# Altium schematic sheet POWER_GEN.SchDoc: =project_title
size Tabloid; CompanyName: Luxonis Holding; Organization: Luxonis Holding; Address1: 1925 Harmony Park Drive; Address2: Westminster, CO; Address3: 80234; Address4: United States; SheetNumber: 4; SheetTotal: 14
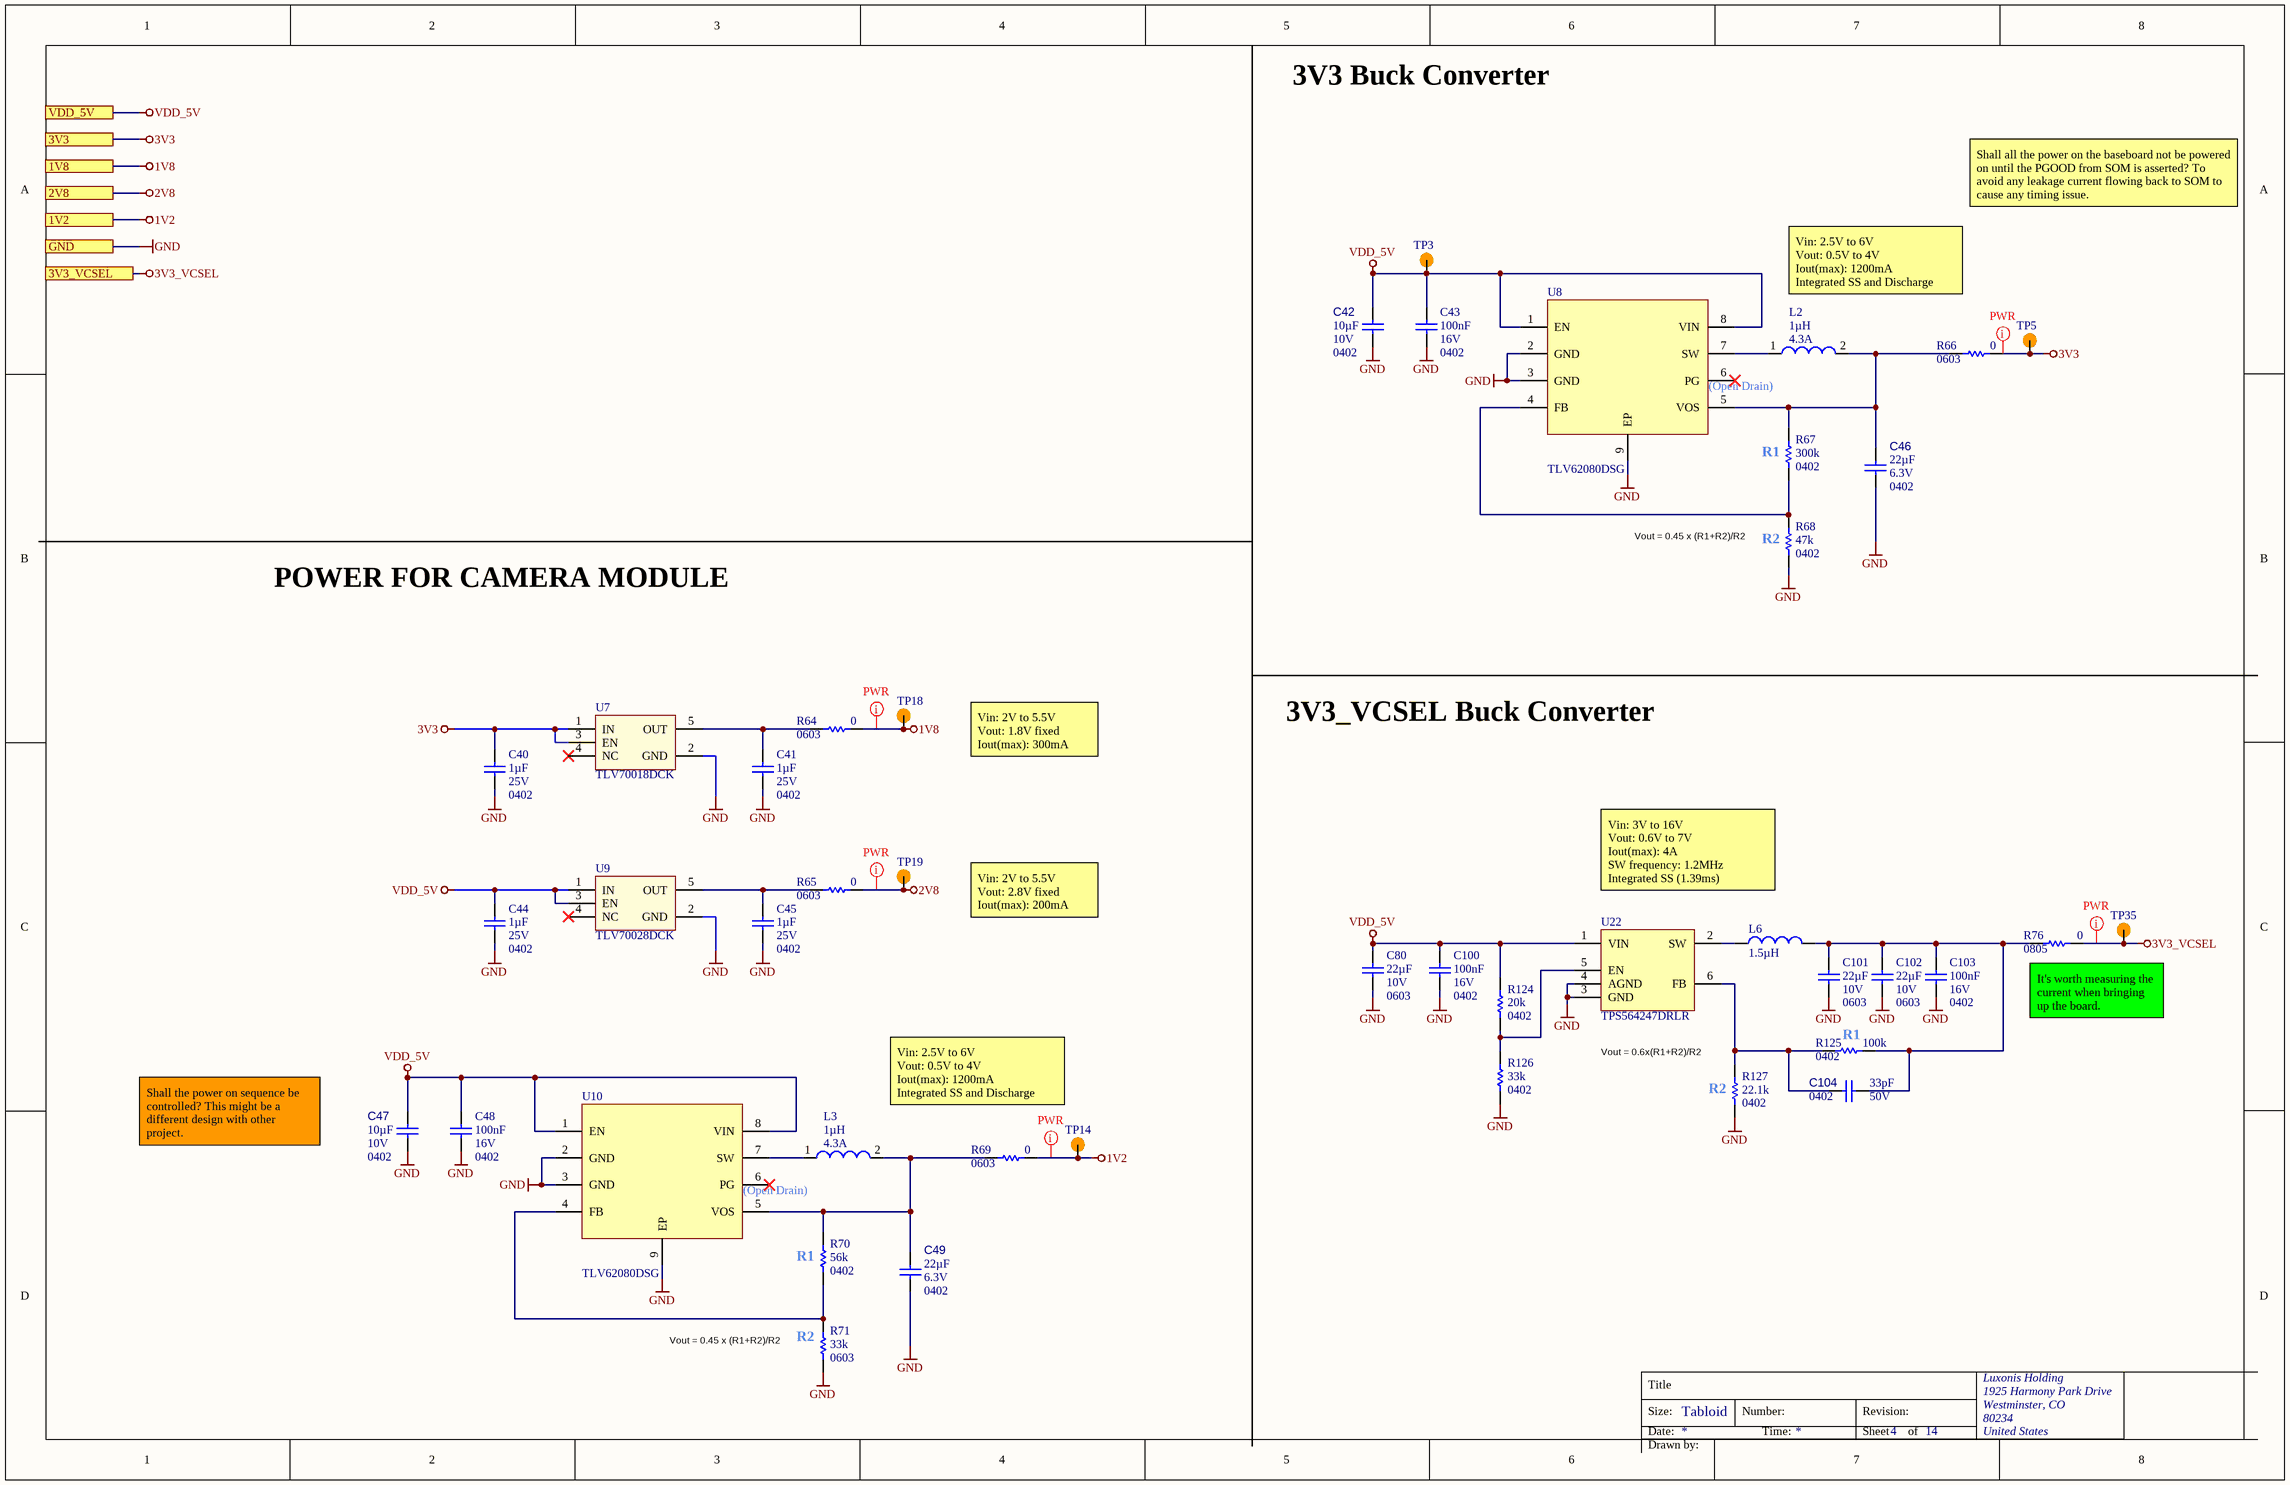
[diagram p0: POWER_GEN.SchDoc]

## Parts
C40  value 1µF  Voltage Rating: 25V  Case/Package: 0402  [CAPC0402(1005)70_N]  (hidden comment: GRM155R61E105KA12D)
C41  value 1µF  Voltage Rating: 25V  Case/Package: 0402  [CAPC0402(1005)70_N]  (hidden comment: GRM155R61E105KA12D)
C42  value 10µF  Voltage Rating: 10V  Case/Package: 0402  [CAPC0402(1005)60_L]  (hidden comment: GRM155R61A106ME11D)
C43  value 100nF  Voltage Rating: 16V  Case/Package: 0402  [CAPC0402(1005)60_N]  (hidden comment: CL05B104KO5NFNC)
C44  value 1µF  Voltage Rating: 25V  Case/Package: 0402  [CAPC0402(1005)70_N]  (hidden comment: GRM155R61E105KA12D)
C45  value 1µF  Voltage Rating: 25V  Case/Package: 0402  [CAPC0402(1005)70_N]  (hidden comment: GRM155R61E105KA12D)
C46  value 22µF  Voltage Rating: 6.3V  Case/Package: 0402  [CAPC0402(1005)60_L]  (hidden comment: CL05A226MQ5N6J8)
C47  value 10µF  Voltage Rating: 10V  Case/Package: 0402  [CAPC0402(1005)60_L]  (hidden comment: GRM155R61A106ME11D)
C48  value 100nF  Voltage Rating: 16V  Case/Package: 0402  [CAPC0402(1005)60_N]  (hidden comment: CL05B104KO5NFNC)
C49  value 22µF  Voltage Rating: 6.3V  Case/Package: 0402  [CAPC0402(1005)60_L]  (hidden comment: CL05A226MQ5N6J8)
C80  value 22µF  Voltage Rating: 10V  Case/Package: 0603  [CAPC0603(1608)100_N]  (hidden comment: GRM188R61A226ME15D)
C100  value 100nF  Voltage Rating: 16V  Case/Package: 0402  [CAPC0402(1005)60_N]  (hidden comment: CL05B104KO5NFNC)
C101  value 22µF  Voltage Rating: 10V  Case/Package: 0603  [CAPC0603(1608)100_N]  (hidden comment: GRM188R61A226ME15D)
C102  value 22µF  Voltage Rating: 10V  Case/Package: 0603  [CAPC0603(1608)100_N]  (hidden comment: GRM188R61A226ME15D)
C103  value 100nF  Voltage Rating: 16V  Case/Package: 0402  [CAPC0402(1005)60_N]  (hidden comment: CL05B104KO5NFNC)
C104  value 33pF  Voltage Rating: 50V  Case/Package: 0402  [FP-GCM155-0_05-IPC_A]  (hidden comment: GCM1555C1H330JA16D)
L2  value 1µH  Current Rating: 4.3A  [DFE252012P-1R0M=P2]  (hidden comment: DFE252012P-1R0M=P2)
L3  value 1µH  Current Rating: 4.3A  [DFE252012P-1R0M=P2]  (hidden comment: DFE252012P-1R0M=P2)
L6  value 1.5µH  [FP-SRP6540-MFG]  (hidden comment: SRP6540-1R5M)
R64  value 0  Case/Package: 0603  [RESC0603(1608)_N]  (hidden comment: CRCW06030000Z0EA)
R65  value 0  Case/Package: 0603  [RESC0603(1608)_N]  (hidden comment: CRCW06030000Z0EA)
R66  value 0  Case/Package: 0603  [RESC0603(1608)_N]  (hidden comment: CRCW06030000Z0EA)
R67  value 300k  Case/Package: 0402  [RESC0402(1005)_N]  (hidden comment: RC0402FR-07300KL)
R68  value 47k  Case/Package: 0402  [RESC0402(1005)_L]  (hidden comment: RC0402FR-0747KL)
R69  value 0  Case/Package: 0603  [RESC0603(1608)_N]  (hidden comment: CRCW06030000Z0EA)
R70  value 56k  Case/Package: 0402  [RESC0402(1005)_L]  (hidden comment: RC0402FR-0756KL)
R71  value 33k  Case/Package: 0603  [RESC1608X55X25LL10T15]  (hidden comment: RC0603FR-0733KL)
R76  value 0  Case/Package: 0805  [RESC0805(2012)_L]  (hidden comment: CRCW08050000Z0EA)
R124  value 20k  Case/Package: 0402  [RESC0402(1005)_L]  (hidden comment: RC0402FR-0720KL)
R125  value 100k  Case/Package: 0402  [RESC0402(1005)_L]  (hidden comment: RC0402FR-07100KL)
R126  value 33k  Case/Package: 0402  [RESC0402(1005)_L]  (hidden comment: CRCW040233K0FKED)
R127  value 22.1k  Case/Package: 0402  [RESC0402(1005)_N]  (hidden comment: RC0402FR-0722K1L)
TP3  TP075_150_NS  [TP075_150_NS]  (value not drawn)  (no BOM)
TP5  TP075_150_NS  [TP075_150_NS]  (value not drawn)  (no BOM)
TP14  TP075_150_NS  [TP075_150_NS]  (value not drawn)  (no BOM)
TP18  TP075_150_NS  [TP075_150_NS]  (value not drawn)  (no BOM)
TP19  TP075_150_NS  [TP075_150_NS]  (value not drawn)  (no BOM)
TP35  TP075_150_NS  [TP075_150_NS]  (value not drawn)  (no BOM)
U7  TLV70018DCK  [TLV70018DCK]
U8  TLV62080DSG  [TLV62080DSG]
U9  TLV70028DCK  [TLV70028DCK]
U10  TLV62080DSG  [TLV62080DSG]
U22  TPS564247DRLR  [TPS564247DRLR-Footprint-1]

## Ports
1V2, 1V8, 2V8, 3V3, 3V3_VCSEL, GND, VDD_5V

## Nets
1V2: R69.2 TP14.1 ; port 1V2
1V8: R64.2 TP18.1 ; port 1V8
2V8: R65.2 TP19.1 ; port 2V8
3V3: C40.2 R66.2 TP5.1 U7.1(IN) U7.3(EN) ; port 3V3
3V3_VCSEL: R76.2 TP35.1 ; port 3V3_VCSEL
GND: C40.1 C41.1 C42.1 C43.1 C44.1 C45.1 C46.1 C47.1 C48.1 C49.1 C80.1 C100.1 C101.1 C102.1 C103.1 R68.1 R71.1 R126.1 R127.1 U7.2(GND) U8.2(GND) U8.3(GND) U8.9(EP) U9.2(GND) U10.2(GND) U10.3(GND) U10.9(EP) U22.3(GND) U22.4(AGND) ; port GND
VDD_5V: C42.2 C43.2 C44.2 C47.2 C48.2 C80.2 C100.2 R124.2 TP3.1 U8.1(EN) U8.8(VIN) U9.1(IN) U9.3(EN) U10.1(EN) U10.8(VIN) U22.1(VIN) ; port VDD_5V
NetC41_2: C41.2 R64.1 U7.5(OUT)
NetC45_2: C45.2 R65.1 U9.5(OUT)
NetC46_2: C46.2 L2.2 R66.1 R67.2 U8.5(VOS)
NetC49_2: C49.2 L3.2 R69.1 R70.2 U10.5(VOS)
NetC101_2: C101.2 C102.2 C103.2 C104.1 L6.2 R76.1 R125.1
NetC104_2: C104.2 R125.2 R127.2 U22.6(FB)
NetL2_1: L2.1 U8.7(SW)
NetL3_1: L3.1 U10.7(SW)
NetL6_1: L6.1 U22.2(SW)
NetR67_1: R67.1 R68.2 U8.4(FB)
NetR70_1: R70.1 R71.2 U10.4(FB)
NetR124_1: R124.1 R126.2 U22.5(EN)

Not connected (* = marked no-connect by the designer): U7 4(NC)*; U8 6(PG)*; U9 4(NC)*; U10 6(PG)*

## Layout directives
net class PWR; Current Rating: 200mA: 1V8
net class PWR; Current Rating: 300mA: 2V8
net class PWR; Current Rating: 1200mA: 1V2, 3V3
net class PWR; Current Rating: 3A: 3V3_VCSEL

## Notes on the sheet
- 3V3 Buck Converter
- Shall all the power on the baseboard not be powered on until the PGOOD from SOM is asserted? To avoid any leakage current flowing back to SOM to cause any timing issue.
- Vin: 2.5V to 6V
  Vout: 0.5V to 4V
  Iout(max): 1200mA
  Integrated SS and Discharge
- (near U8) (Open Drain)
- (near R67) R1
- (near R68) Vout = 0.45 x (R1+R2)/R2
- (near R68) R2
- POWER FOR CAMERA MODULE
- Vin: 2V to 5.5V
  Vout: 1.8V fixed
  Iout(max): 300mA
- 3V3_VCSEL Buck Converter
- Vin: 3V to 16V
  Vout: 0.6V to 7V
  Iout(max): 4A
  SW frequency: 1.2MHz
  Integrated SS (1.39ms)
- Vin: 2V to 5.5V
  Vout: 2.8V fixed
  Iout(max): 200mA
- It's worth measuring the current when bringing up the board.
- (near R127) Vout = 0.6x(R1+R2)/R2
- (near R127) R2
- (near R125) R1
- Shall the power on sequence be controlled? This might be a different design with other project.
- (near U10) (Open Drain)
- (near R70) R1
- (near R71) Vout = 0.45 x (R1+R2)/R2
- (near R71) R2
- Title
- Size:
- Date:
- Tabloid
- Number:
- Time:
- Revision:
- Sheet
- of
- Drawn by:

## Library data of the parts
C40 C41 C44 C45 = CMP-108-000014-5: CAP CER 1UF 25V X5R 0402 10%; Manufacturer 1: Murata; ComponentLink2Description: https://datasheet.ciiva.com/7719/1666664-7719006.pdf?src-supplier=Element14; ComponentLink2URL: https://datasheet.ciiva.com/7719/1666664-7719006.pdf?src-supplier=Element14; Max Operating Temperature: 85°C; Depth: 0.5mm; Mounting Technology: SMT; ComponentLink1URL: https://datasheet.ciiva.com/22732/1666664-22732122.pdf?src-supplier=Element14; Length: 1mm; ComponentLink1Description: https://datasheet.ciiva.com/22732/1666664-22732122.pdf?src-supplier=Element14; Manufacturer Part Number 1: GRM155R61E105KA12D; Tolerance: 10%; Design Item ID: GRM155R61E105KA12D; Dielectric: X5R; Min Operating Temperature: -55°C; Height: 0.5mm; Width: 0.5mm
C42 C47 = CMP-001-00125-4: CAP CER 10UF 10V X5R 0402 20%; Manufacturer 1: Murata; Mounting Technology: SMT; Tolerance: 20%; Manufacturer Part Number 1: GRM155R61A106ME11D; Dielectric: X5R
C43 C48 C100 C103 = CMP-108-000002-6: CAP CER 0.1UF 16V X7R 0402 10%; Manufacturer 1: Samsung; ComponentLink1URL: https://datasheet.ciiva.com/25767/cl05b104ko5nfnc-25767124.pdf?src-supplier=Digi-Key; Length: 1mm; Design Item ID: CL05B104KO5NFNC; Tolerance: 10%; Min Operating Temperature: -55°C; Width: 0.02inch; Dielectric: X7R; ComponentLink1Description: https://datasheet.ciiva.com/25767/cl05b104ko5nfnc-25767124.pdf?src-supplier=Digi-Key; Height: 0.5mm; Depth: 0.5mm; Manufacturer Part Number 1: CL05B104KO5NFNC; Max Operating Temperature: 125°C; Mounting Technology: SMT
C46 C49 = CMP-001-00163-4: CAP CER 22UF 6.3V X5R 0402 20%; Manufacturer 1: Samsung; Manufacturer Part Number 1: CL05A226MQ5N6J8; Mounting Technology: Surface Mount; Tolerance: 20%
C80 C101 C102 = CMP-108-000020-4: CAP CER 22UF 10V X5R 0603 20%; Manufacturer 1: Murata; ComponentLink1Description: https://datasheet.ciiva.com/46444/1769893-46444975.pdf?src-supplier=Element14; ComponentLink1URL: https://datasheet.ciiva.com/46444/1769893-46444975.pdf?src-supplier=Element14; Mounting Technology: SMT; Width: 0.8mm; Length: 1.6mm; Height: 0.8mm; Design Item ID: GRM188R61A226ME15D; Manufacturer Part Number 1: GRM188R61A226ME15D; Depth: 0.8mm; Tolerance: 20%; Min Operating Temperature: -55°C; Dielectric: X5R; Max Operating Temperature: 85°C
C104 = CMP-001-00100-6: CAP CER 33pF 50V C0G 0402 5%; Manufacturer 1: Murata; Capacitor Type: Ceramic; Mounting Technology: SMT; Dielectric: C0G; Manufacturer Part Number 1: GCM1555C1H330JA16D; Tolerance: 5%
L2 L3 = CMP-082-000001-2: FIXED IND 1UH 3.2A 42 MOHM SMD; Manufacturer: Murata; Tolerance: 20%; Manufacturer Part Number: DFE252012P-1R0M=P2; Case/Package: 1008; Manufacturer 1: Murata; Manufacturer Part Number 1: DFE252012P-1R0M=P2; Manufacturer 2: Murata; Manufacturer Part Number 2: DFE252012P-1R0M=P2; Manufacturer 3: Murata; Manufacturer Part Number 3: DFE252012P-1R0M=P2; Manufacturer 4: Murata; Manufacturer Part Number 4: DFE252012P-1R0M=P2
L6 = CMP-006-00052-1: General Purpose Inductor, 1.5uH, 20%, 1 Element, Powdered Iron-Core, SMD, 2826; Manufacturer 1: Bourns; Saturation Current: 11A; Current Rating: 11A; Tolerance: 20%; Case/Package: 2826; Manufacturer Part Number 1: SRP6540-1R5M
R64-R66 R69 = CMP-115-000011-7: RES SMD 0 OHM 5% 1/10W 0603; Manufacturer 1: Vishay; Manufacturer Part Number 1: CRCW0603-0000Z0EA; Temperature Coefficient: 100ppm/°C; Power Rating: 100mW; Voltage Rating: 75V; Tolerance: 5%; Design Item ID: CRCW06030000Z0EA; Max Operating Temperature: 155°C; Min Operating Temperature: -55°C
R67 = CMP-013-000049-8: RES SMD 300K OHM 1% 1/16W 0402; Manufacturer 1: Yageo; Voltage Rating: 50V; Power Rating: 63mW; Tolerance: 1%; Design Item ID: RC0402FR-07300KL; Max Operating Temperature: 155°C; Manufacturer Part Number 1: RC0402FR-07300KL; Min Operating Temperature: -55°C
R68 = CMP-013-000015-9: RES SMD 47K OHM 1% 1/16W 0402; Manufacturer 1: Yageo; Power Rating: 62.5mW; Voltage Rating: 50V; Max Operating Temperature: 155°C; Tolerance: 1%; Min Operating Temperature: -55°C; Manufacturer Part Number 1: RC0402FR-0747KL; Design Item ID: RC0402FR-0747KL
R70 = CMP-013-000017-11: RES SMD 56K OHM 1% 1/16W 0402; Manufacturer 1: Yageo; Power Rating: 62.5mW; Voltage Rating: 50V; Manufacturer Part Number 1: RC0402FR-0756KL; Tolerance: 1%; Min Operating Temperature: -55°C; Max Operating Temperature: 155°C
R71 = CMP-009-00229-8: RES SMD 33K OHM 1% 0.1W 0603; Manufacturer 1: Yageo; Voltage Rating: 75V; Power Rating: 100mW; Mounting Technology: SMD; Tolerance: 1%; Pins: 2; Manufacturer Part Number 1: RC0603FR-0733KL
R76 = CMP-013-000034-9: RES SMD 0 OHM 1% 1/8W 0805; Manufacturer 1: Vishay; Power Rating: 125mW; Manufacturer Part Number 1: CRCW08050000Z0EA; Max Operating Temperature: 155°C; Min Operating Temperature: -55°C; Design Item ID: CRCW08050000Z0EA
R124 = CMP-013-000011-9: RES SMD 20K OHM 1% 1/16W 0402; Manufacturer 1: Yageo; Power Rating: 62.5mW; Voltage Rating: 50V; Max Operating Temperature: 155°C; Manufacturer Part Number 1: RC0402FR-0720KL; Min Operating Temperature: -55°C; Design Item ID: RC0402FR-0720KL; Tolerance: 1%
R125 = CMP-013-000035-8: RES SMD 100K OHM 1% 1/16W 0402; Manufacturer 1: Yageo; Power Rating: 63mW; Voltage Rating: 50V; Tolerance: 1%; Min Operating Temperature: -55°C; Max Operating Temperature: 155°C; Design Item ID: RC0402FR-07100KL; Manufacturer Part Number 1: RC0402FR-07100KL
R126 = CMP-013-000025-8: RES SMD 33K OHM 1% 1/16W 0402; Manufacturer 1: Vishay; Voltage Rating: 50V; Power Rating: 63mW; Tolerance: 1%; Max Operating Temperature: 155°C; Design Item ID: CRCW040233K0FKED; Manufacturer Part Number 1: CRCW040233K0FKED; Min Operating Temperature: -55°C
R127 = CMP-013-000045-8: RES SMD 22.1K OHM 1% 1/16W 0402; Manufacturer 1: Yageo; Power Rating: 62.5mW; Voltage Rating: 50V; Min Operating Temperature: -55°C; Max Operating Temperature: 155°C; Tolerance: 1%; Design Item ID: RC0402FR-0722K1L; Manufacturer Part Number 1: RC0402FR-0722K1L
TP3 TP5 TP14 TP18 TP19 TP35 = TEST_POINT
U7 = CMP-113-000003-2: IC REG LINEAR 1.8V 200MA SC70-5 Linear Voltage Regulator IC  1 Output  200mA SC-70-5; Manufacturer 1: Texas Instruments; Manufacturer Part Number 1: TLV70018DCKR; Max Supply Voltage: 5.5V; Min Supply Voltage: 2V; Min Operating Temperature: -40°C; Pins: 5; Max Output Voltage: 1.8V; Max Operating Temperature: 125°C; Case/Package: SC; Max Output Current: 200mA; Min Output Voltage: 1.8V
U8 U10 = CMP-010-000007-3: IC REG BUCK ADJ 1.2A SYNC 8WSON; Manufacturer Part Number 1: TLV62080DSGR; Manufacturer 1: Texas Instruments; Output Voltage: 4V; Min Output Voltage: 500mV; Max Supply Voltage: 5.5V; Min Supply Voltage: 2.5V; Vfb/Vout: 0V; Max Output Current: 1.2A; Max Operating Temperature: 125°C; Max Output Voltage: 4V; Min Operating Temperature: -40°C
U9 = CMP-055-000001-3: IC REG LINEAR 2.8V 200MA SC70-5 Linear Voltage Regulator IC  1 Output  200mA SC-70-5; Manufacturer 1: Texas Instruments; Manufacturer Part Number 1: TLV70028DCKT; Max Supply Voltage: 5.5V; Min Supply Voltage: 2V; Pins: 5; Max Operating Temperature: 125°C; Max Output Voltage: 2.8V; Min Operating Temperature: -40°C; Case/Package: SC; Min Output Voltage: 2.8V; Max Output Current: 200mA
U22 = CMP-019-00082-1: 3-V to 16-V input voltage, 4-A FCCM mode, synchronous buck converter in SOT-563 package 6-SOT-5X3 -40 to 125; Manufacturer 1: Texas Instruments; Frequency: 1.2MHz; Min Supply Voltage: 3V; Vfb/Vout: 650mV; Max Supply Voltage: 16V; Max Output Current: 4A; Min Operating Temperature: -40°C; Case/Package: SOT-563; Max Operating Temperature: 125°C; Manufacturer Part Number 1: TPS564247DRLR; Pins: 6